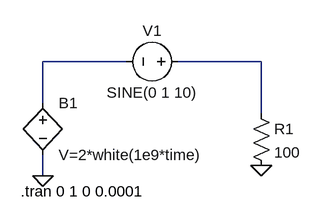
[diagram p0: schematic test_bruit.asc]
test_bruit.asc, the LTspice schematic file:
Version 4
SHEET 1 880 680
WIRE 240 32 112 32
WIRE 448 32 320 32
WIRE 112 96 112 32
WIRE 448 112 448 32
WIRE 112 208 112 176
FLAG 112 208 0
FLAG 448 192 0
SYMBOL bv 112 80 R0
SYMATTR InstName B1
SYMATTR Value V=2*white(1e9*time)
SYMBOL res 432 96 R0
SYMATTR InstName R1
SYMATTR Value 100
SYMBOL voltage 336 32 R90
WINDOW 0 -32 56 VBottom 2
WINDOW 3 32 56 VTop 2
WINDOW 123 60 56 VTop 2
WINDOW 39 0 0 Left 2
SYMATTR InstName V1
SYMATTR Value SINE(0 1 10)
TEXT 78 232 Left 2 !.tran 0 1 0 0.0001

The netlist it stands for:
* test_bruit.asc
B1 N001 0 V=2*white(1e9*time)
R1 N002 0 100
V1 N002 N001 SINE(0 1 10)
.tran 0 1 0 0.0001
.backanno
.end